# Altium project Analog_Digital_Testbed.PrjPcb
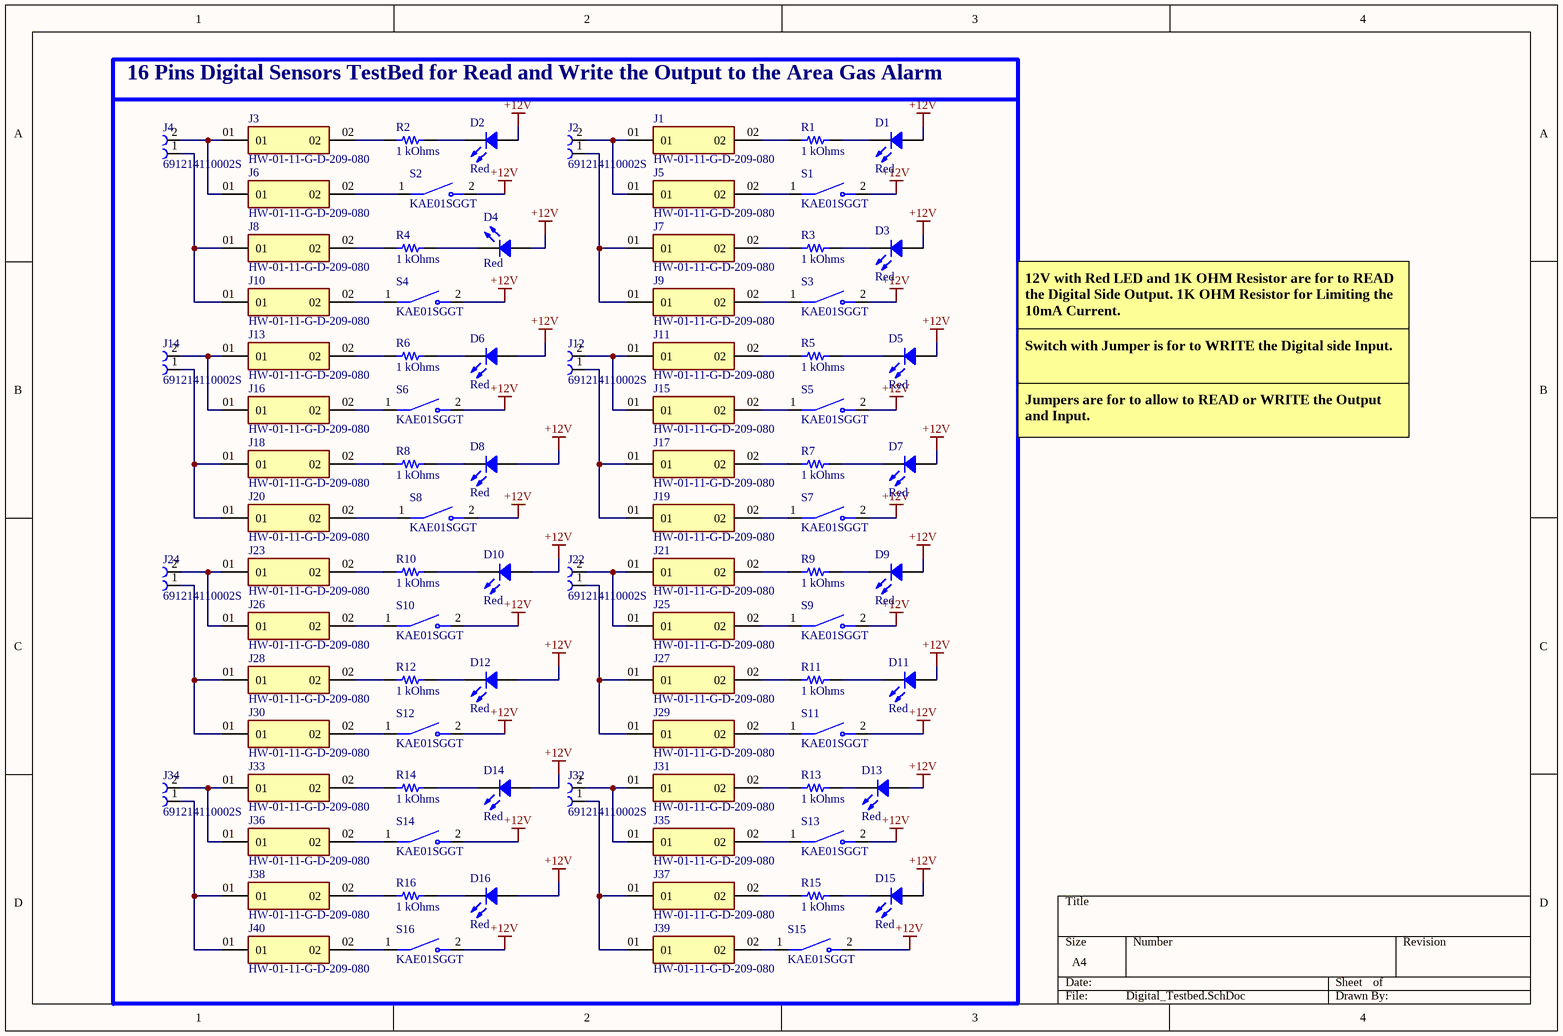
[diagram p0: Digital_Testbed.SchDoc]
4 sheets, 195 parts. Net scope: global (net labels, ports and power ports of the same name join across sheets).
Board file: PCB1.PcbDoc
Sheets:
  Digital_Testbed.SchDoc
  Analog_Testbed.SchDoc
  Voltage_Regulator.SchDoc
  rs485.SchDoc

## Sheet Digital_Testbed.SchDoc
size A4; SheetNumber: 1; SheetTotal: 4

### Parts
D1  Red  [LED 0603_1608 RED]
D2  Red  [LED 0603_1608 RED]
D3  Red  [LED 0603_1608 RED]
D4  Red  [LED 0603_1608 RED]
D5  Red  [LED 0603_1608 RED]
D6  Red  [LED 0603_1608 RED]
D7  Red  [LED 0603_1608 RED]
D8  Red  [LED 0603_1608 RED]
D9  Red  [LED 0603_1608 RED]
D10  Red  [LED 0603_1608 RED]
D11  Red  [LED 0603_1608 RED]
D12  Red  [LED 0603_1608 RED]
D13  Red  [LED 0603_1608 RED]
D14  Red  [LED 0603_1608 RED]
D15  Red  [LED 0603_1608 RED]
D16  Red  [LED 0603_1608 RED]
J1  HW-01-11-G-D-209-080  [SAMTEC_HW-01-11-G-D-209-080]
J2  691214110002S  [691214110002S]
J3  HW-01-11-G-D-209-080  [SAMTEC_HW-01-11-G-D-209-080]
J4  691214110002S  [691214110002S]
J5  HW-01-11-G-D-209-080  [SAMTEC_HW-01-11-G-D-209-080]
J6  HW-01-11-G-D-209-080  [SAMTEC_HW-01-11-G-D-209-080]
J7  HW-01-11-G-D-209-080  [SAMTEC_HW-01-11-G-D-209-080]
J8  HW-01-11-G-D-209-080  [SAMTEC_HW-01-11-G-D-209-080]
J9  HW-01-11-G-D-209-080  [SAMTEC_HW-01-11-G-D-209-080]
J10  HW-01-11-G-D-209-080  [SAMTEC_HW-01-11-G-D-209-080]
J11  HW-01-11-G-D-209-080  [SAMTEC_HW-01-11-G-D-209-080]
J12  691214110002S  [691214110002S]
J13  HW-01-11-G-D-209-080  [SAMTEC_HW-01-11-G-D-209-080]
J14  691214110002S  [691214110002S]
J15  HW-01-11-G-D-209-080  [SAMTEC_HW-01-11-G-D-209-080]
J16  HW-01-11-G-D-209-080  [SAMTEC_HW-01-11-G-D-209-080]
J17  HW-01-11-G-D-209-080  [SAMTEC_HW-01-11-G-D-209-080]
J18  HW-01-11-G-D-209-080  [SAMTEC_HW-01-11-G-D-209-080]
J19  HW-01-11-G-D-209-080  [SAMTEC_HW-01-11-G-D-209-080]
J20  HW-01-11-G-D-209-080  [SAMTEC_HW-01-11-G-D-209-080]
J21  HW-01-11-G-D-209-080  [SAMTEC_HW-01-11-G-D-209-080]
J22  691214110002S  [691214110002S]
J23  HW-01-11-G-D-209-080  [SAMTEC_HW-01-11-G-D-209-080]
J24  691214110002S  [691214110002S]
J25  HW-01-11-G-D-209-080  [SAMTEC_HW-01-11-G-D-209-080]
J26  HW-01-11-G-D-209-080  [SAMTEC_HW-01-11-G-D-209-080]
J27  HW-01-11-G-D-209-080  [SAMTEC_HW-01-11-G-D-209-080]
J28  HW-01-11-G-D-209-080  [SAMTEC_HW-01-11-G-D-209-080]
J29  HW-01-11-G-D-209-080  [SAMTEC_HW-01-11-G-D-209-080]
J30  HW-01-11-G-D-209-080  [SAMTEC_HW-01-11-G-D-209-080]
J31  HW-01-11-G-D-209-080  [SAMTEC_HW-01-11-G-D-209-080]
J32  691214110002S  [691214110002S]
J33  HW-01-11-G-D-209-080  [SAMTEC_HW-01-11-G-D-209-080]
J34  691214110002S  [691214110002S]
J35  HW-01-11-G-D-209-080  [SAMTEC_HW-01-11-G-D-209-080]
J36  HW-01-11-G-D-209-080  [SAMTEC_HW-01-11-G-D-209-080]
J37  HW-01-11-G-D-209-080  [SAMTEC_HW-01-11-G-D-209-080]
J38  HW-01-11-G-D-209-080  [SAMTEC_HW-01-11-G-D-209-080]
J39  HW-01-11-G-D-209-080  [SAMTEC_HW-01-11-G-D-209-080]
J40  HW-01-11-G-D-209-080  [SAMTEC_HW-01-11-G-D-209-080]
R1  1 kOhms  [RES 0603_1608]
R2  1 kOhms  [RES 0603_1608]
R3  1 kOhms  [RES 0603_1608]
R4  1 kOhms  [RES 0603_1608]
R5  1 kOhms  [RES 0603_1608]
R6  1 kOhms  [RES 0603_1608]
R7  1 kOhms  [RES 0603_1608]
R8  1 kOhms  [RES 0603_1608]
R9  1 kOhms  [RES 0603_1608]
R10  1 kOhms  [RES 0603_1608]
R11  1 kOhms  [RES 0603_1608]
R12  1 kOhms  [RES 0603_1608]
R13  1 kOhms  [RES 0603_1608]
R14  1 kOhms  [RES 0603_1608]
R15  1 kOhms  [RES 0603_1608]
R16  1 kOhms  [RES 0603_1608]
S1  KAE01SGGT  [SW_KAE01SGGT]
S2  KAE01SGGT  [SW_KAE01SGGT]
S3  KAE01SGGT  [SW_KAE01SGGT]
S4  KAE01SGGT  [SW_KAE01SGGT]
S5  KAE01SGGT  [SW_KAE01SGGT]
S6  KAE01SGGT  [SW_KAE01SGGT]
S7  KAE01SGGT  [SW_KAE01SGGT]
S8  KAE01SGGT  [SW_KAE01SGGT]
S9  KAE01SGGT  [SW_KAE01SGGT]
S10  KAE01SGGT  [SW_KAE01SGGT]
S11  KAE01SGGT  [SW_KAE01SGGT]
S12  KAE01SGGT  [SW_KAE01SGGT]
S13  KAE01SGGT  [SW_KAE01SGGT]
S14  KAE01SGGT  [SW_KAE01SGGT]
S15  KAE01SGGT  [SW_KAE01SGGT]
S16  KAE01SGGT  [SW_KAE01SGGT]

### Nets
+12V: D1.1 D2.1 D3.1 D4.1 D5.1 D6.1 D7.1 D8.1 D9.1 D10.1 D11.1 D12.1 D13.1 D14.1 D15.1 D16.1 S1.2 S2.2 S3.2 S4.2 S5.2 S6.2 S7.2 S8.2 S9.2 S10.2 S11.2 S12.2 S13.2 S14.2 S15.2 S16.2
NetD1_2: D1.2 R1.2
NetD2_2: D2.2 R2.2
NetD3_2: D3.2 R3.2
NetD4_2: D4.2 R4.2
NetD5_2: D5.2 R5.2
NetD6_2: D6.2 R6.2
NetD7_2: D7.2 R7.2
NetD8_2: D8.2 R8.2
NetD9_2: D9.2 R9.2
NetD10_2: D10.2 R10.2
NetD11_2: D11.2 R11.2
NetD12_2: D12.2 R12.2
NetD13_2: D13.2 R13.2
NetD14_2: D14.2 R14.2
NetD15_2: D15.2 R15.2
NetD16_2: D16.2 R16.2
NetJ1_01: J1.01 J2.2 J5.01
NetJ1_02: J1.02 R1.1
NetJ2_1: J2.1 J7.01 J9.01
NetJ3_01: J3.01 J4.2 J6.01
NetJ3_02: J3.02 R2.1
NetJ4_1: J4.1 J8.01 J10.01
NetJ5_02: J5.02 S1.1
NetJ6_02: J6.02 S2.1
NetJ7_02: J7.02 R3.1
NetJ8_02: J8.02 R4.1
NetJ9_02: J9.02 S3.1
NetJ10_02: J10.02 S4.1
NetJ11_01: J11.01 J12.2 J15.01
NetJ11_02: J11.02 R5.1
NetJ12_1: J12.1 J17.01 J19.01
NetJ13_01: J13.01 J14.2 J16.01
NetJ13_02: J13.02 R6.1
NetJ14_1: J14.1 J18.01 J20.01
NetJ15_02: J15.02 S5.1
NetJ16_02: J16.02 S6.1
NetJ17_02: J17.02 R7.1
NetJ18_02: J18.02 R8.1
NetJ19_02: J19.02 S7.1
NetJ20_02: J20.02 S8.1
NetJ21_01: J21.01 J22.2 J25.01
NetJ21_02: J21.02 R9.1
NetJ22_1: J22.1 J27.01 J29.01
NetJ23_01: J23.01 J24.2 J26.01
NetJ23_02: J23.02 R10.1
NetJ24_1: J24.1 J28.01 J30.01
NetJ25_02: J25.02 S9.1
NetJ26_02: J26.02 S10.1
NetJ27_02: J27.02 R11.1
NetJ28_02: J28.02 R12.1
NetJ29_02: J29.02 S11.1
NetJ30_02: J30.02 S12.1
NetJ31_01: J31.01 J32.2 J35.01
NetJ31_02: J31.02 R13.1
NetJ32_1: J32.1 J37.01 J39.01
NetJ33_01: J33.01 J34.2 J36.01
NetJ33_02: J33.02 R14.1
NetJ34_1: J34.1 J38.01 J40.01
NetJ35_02: J35.02 S13.1
NetJ36_02: J36.02 S14.1
NetJ37_02: J37.02 R15.1
NetJ38_02: J38.02 R16.1
NetJ39_02: J39.02 S15.1
NetJ40_02: J40.02 S16.1

### Notes on the sheet
- 16 Pins Digital Sensors TestBed for Read and Write the Output to the Area Gas Alarm
- 12V with Red LED and 1K OHM Resistor are for to READ the Digital Side Output. 1K OHM Resistor for Limiting the 10mA Current.
- Switch with Jumper is for to WRITE the Digital side Input.
- Jumpers are for to allow to READ or WRITE the Output and Input.

### Library data of the parts
D1-D16 = 19-213SDRC/S259/TR8: LED RED CLEAR 2SMD; Manufacturer: Everlight Electronics Co Ltd; Configuration: Standard; Current - Test: 10mA; Lens Color: Colorless; Lens Size: 1.20mm x 0.80mm; Lens Style: Rectangle with Flat Top; Viewing Angle: 120°; Voltage - Forward (Vf) (Typ): 2V; Wavelength - Peak: 650nm; Part Number: 19-213SDRC/S259/TR8; Color: Red; ComponentLink1Description: Datasheet; ComponentLink1URL: //media.digikey.com/pdf/Data%20Sheets/Everlight%20PDFs/19-213SDRC-S259-TR8.pdf; ComponentLink2Description: DigiKey Link; ComponentLink2URL: http://digikey.com/product-detail/en/everlight-electronics-co-ltd/19-213SDRC-S259-TR8/1080-1580-1-ND/8535303; Device Package: 0603 (1608 Metric); Height (Max): 0.70mm; LastUpdated: 08/03/2023 8:58:11 pm; Lens Transparency: Clear; Lifecycle Status: Active; Minimum Order: 1; Mounting Type: Surface Mount; Package / Case: 0603 (1608 Metric); Packaging: TapeAndReel; PartId: 372; Part Status: Active; Price: 0.06; Series: -; Size / Dimension: 1.60mm L x 0.80mm W; Supplier 1: DigiKey; Supplier Part Number 1: 1080-1580-1-ND; Supplier Device Package: 2-SMD; Value: Red
J1 J3 J5-J11 J13 J15-J21 J23 J25-J31 J33 J35-J40 = HW-01-11-G-D-209-080: CONN HDR 2POS STACK T/H; MF: Samtec; Purchase-URL: https://pricing.snapeda.com/search/part/HW-01-11-G-D-209-080/?ref=eda; Value: *; Package: None; Check_prices: https://www.snapeda.com/parts/HW-01-11-G-D-209-080/Samtec/view-part/?ref=eda; Price: None; MP: HW-01-11-G-D-209-080; Availability: In Stock; SnapEDA_Link: https://www.snapeda.com/parts/HW-01-11-G-D-209-080/Samtec/view-part/?ref=snap
J2 J4 J12 J14 J22 J24 J32 J34 = 691214110002S: 2 Position Wire to Board Terminal Block Horizontal with Board 0.138 (3.50mm) Through Hole; MF: WÃ¼rth Elektronik; Check_prices: https://www.snapeda.com/parts/691214110002S/Wurth+Elektronik/view-part/?ref=eda; Availability: In Stock; Price: None; Package: None; Value: *; SnapEDA_Link: https://www.snapeda.com/parts/691214110002S/Wurth+Elektronik/view-part/?ref=snap; MP: 691214110002S; Purchase-URL: https://pricing.snapeda.com/search/part/691214110002S/?ref=eda
R1-R16 = CPF0603B1K0E: RES SMD 1K OHM 0.1% 1/16W 0603; Manufacturer: TE Connectivity Passive Product; Power (Watts): 0.063W, 1/16W; Temperature Coefficient: ±25ppm/°C; Part Number: CPF0603B1K0E; Value: 1 kOhms; ComponentLink1Description: Datasheet; ComponentLink1URL: https://www.te.com/commerce/DocumentDelivery/DDEController?Action=srchrtrv&DocNm=1773200&DocType=DS&DocLang=English; ComponentLink2Description: DigiKey Link; ComponentLink2URL: https://www.digikey.com/en/products/detail/te-connectivity-passive-product/CPF0603B1K0E/2390473; Composition: Thin Film; Device Package: 0603 (1608 Metric); Height - Seated (Max): 0.022" (0.55mm); LastUpdated: 08/03/2023 8:30:18 pm; Lifecycle Status: Active; Minimum Order: 1; Number of Terminations: 2; Operating Temperature: -55°C ~ 155°C; Package / Case: 0603 (1608 Metric); Packaging: TapeAndReel; PartId: 4877; Part Status: Active; Price: 0.09; Resistance: 1 kOhms; Series: CPF, Neohm; Size / Dimension: 0.061" L x 0.031" W (1.55mm x 0.80mm); Supplier 1: DigiKey; Supplier Part Number 1: A119887CT-ND; Supplier Device Package: 0603; Tolerance: ±0.1%
S1-S16 = KAE01SGGT: Dip Switch SPST 1 Position Surface Mount Slide (Standard) Actuator 25mA 24VDC; MF: E-Switch; Check_prices: https://www.snapeda.com/parts/KAE01SGGT/E-Switch/view-part/?ref=eda; Value: *; Availability: In Stock; MP: KAE01SGGT; Price: None; Package: None; SnapEDA_Link: https://www.snapeda.com/parts/KAE01SGGT/E-Switch/view-part/?ref=snap; Purchase-URL: https://pricing.snapeda.com/search/part/KAE01SGGT/?ref=eda

## Sheet Analog_Testbed.SchDoc
size A4; SheetNumber: 2; SheetTotal: 4
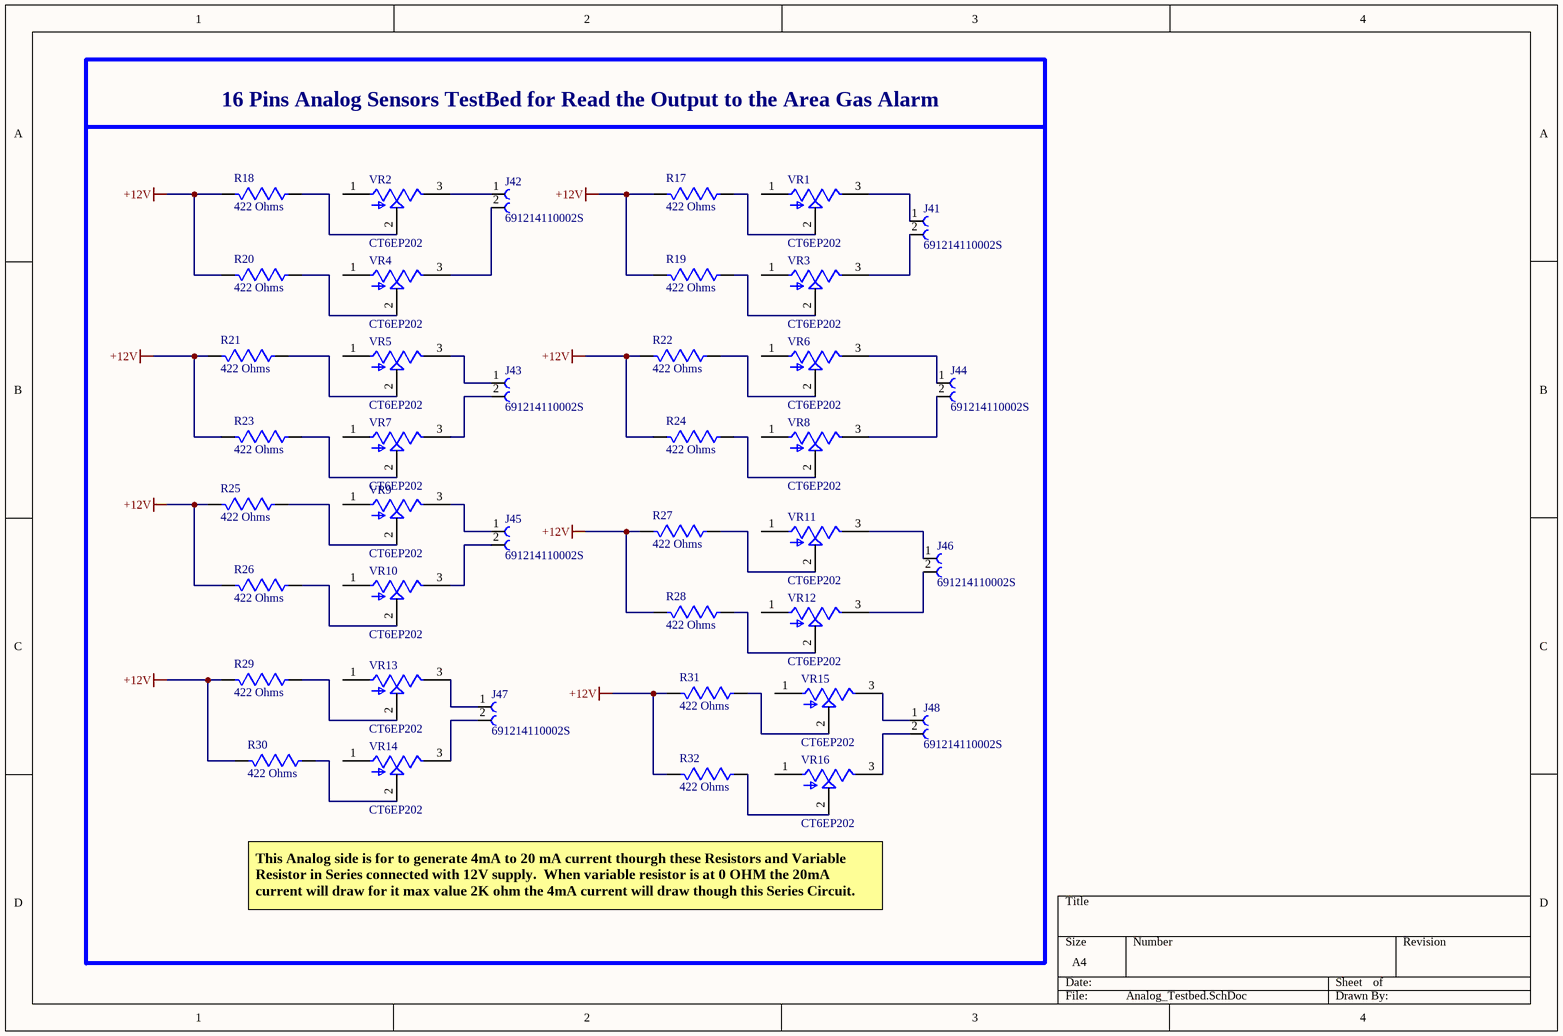
[diagram p1: Analog_Testbed.SchDoc]

### Parts
J41  691214110002S  [691214110002S]
J42  691214110002S  [691214110002S]
J43  691214110002S  [691214110002S]
J44  691214110002S  [691214110002S]
J45  691214110002S  [691214110002S]
J46  691214110002S  [691214110002S]
J47  691214110002S  [691214110002S]
J48  691214110002S  [691214110002S]
R17  422 Ohms  [RES_422]
R18  422 Ohms  [RES_422]
R19  422 Ohms  [RES_422]
R20  422 Ohms  [RES_422]
R21  422 Ohms  [RES_422]
R22  422 Ohms  [RES_422]
R23  422 Ohms  [RES_422]
R24  422 Ohms  [RES_422]
R25  422 Ohms  [RES_422]
R26  422 Ohms  [RES_422]
R27  422 Ohms  [RES_422]
R28  422 Ohms  [RES_422]
R29  422 Ohms  [RES_422]
R30  422 Ohms  [RES_422]
R31  422 Ohms  [RES_422]
R32  422 Ohms  [RES_422]
VR1  CT6EP202  [CT6EP202]
VR2  CT6EP202  [CT6EP202]
VR3  CT6EP202  [CT6EP202]
VR4  CT6EP202  [CT6EP202]
VR5  CT6EP202  [CT6EP202]
VR6  CT6EP202  [CT6EP202]
VR7  CT6EP202  [CT6EP202]
VR8  CT6EP202  [CT6EP202]
VR9  CT6EP202  [CT6EP202]
VR10  CT6EP202  [CT6EP202]
VR11  CT6EP202  [CT6EP202]
VR12  CT6EP202  [CT6EP202]
VR13  CT6EP202  [CT6EP202]
VR14  CT6EP202  [CT6EP202]
VR15  CT6EP202  [CT6EP202]
VR16  CT6EP202  [CT6EP202]

### Nets
+12V: R17.1(CCW) R18.1(CCW) R19.1(CCW) R20.1(CCW) R21.1(CCW) R22.1(CCW) R23.1(CCW) R24.1(CCW) R25.1(CCW) R26.1(CCW) R27.1(CCW) R28.1(CCW) R29.1(CCW) R30.1(CCW) R31.1(CCW) R32.1(CCW)
NetJ41_1: J41.1 VR1.3(CW)
NetJ41_2: J41.2 VR3.3(CW)
NetJ42_1: J42.1 VR2.3(CW)
NetJ42_2: J42.2 VR4.3(CW)
NetJ43_1: J43.1 VR5.3(CW)
NetJ43_2: J43.2 VR7.3(CW)
NetJ44_1: J44.1 VR6.3(CW)
NetJ44_2: J44.2 VR8.3(CW)
NetJ45_1: J45.1 VR9.3(CW)
NetJ45_2: J45.2 VR10.3(CW)
NetJ46_1: J46.1 VR11.3(CW)
NetJ46_2: J46.2 VR12.3(CW)
NetJ47_1: J47.1 VR13.3(CW)
NetJ47_2: J47.2 VR14.3(CW)
NetJ48_1: J48.1 VR15.3(CW)
NetJ48_2: J48.2 VR16.3(CW)
NetR17_2: R17.2(CW) VR1.2(WIPER)
NetR18_2: R18.2(CW) VR2.2(WIPER)
NetR19_2: R19.2(CW) VR3.2(WIPER)
NetR20_2: R20.2(CW) VR4.2(WIPER)
NetR21_2: R21.2(CW) VR5.2(WIPER)
NetR22_2: R22.2(CW) VR6.2(WIPER)
NetR23_2: R23.2(CW) VR7.2(WIPER)
NetR24_2: R24.2(CW) VR8.2(WIPER)
NetR25_2: R25.2(CW) VR9.2(WIPER)
NetR26_2: R26.2(CW) VR10.2(WIPER)
NetR27_2: R27.2(CW) VR11.2(WIPER)
NetR28_2: R28.2(CW) VR12.2(WIPER)
NetR29_2: R29.2(CW) VR13.2(WIPER)
NetR30_2: R30.2(CW) VR14.2(WIPER)
NetR31_2: R31.2(CW) VR15.2(WIPER)
NetR32_2: R32.2(CW) VR16.2(WIPER)

Not connected (* = marked no-connect by the designer): VR1 1(CCW); VR2 1(CCW); VR3 1(CCW); VR4 1(CCW); VR5 1(CCW); VR6 1(CCW); VR7 1(CCW); VR8 1(CCW); VR9 1(CCW); VR10 1(CCW); VR11 1(CCW); VR12 1(CCW); VR13 1(CCW); VR14 1(CCW); VR15 1(CCW); VR16 1(CCW)

### Notes on the sheet
- 16 Pins Analog Sensors TestBed for Read the Output to the Area Gas Alarm
- This Analog side is for to generate 4mA to 20 mA current thourgh these Resistors and Variable Resistor in Series connected with 12V supply.  When variable resistor is at 0 OHM the 20mA current will draw for it max value 2K ohm the 4mA current will draw though this Series Circuit.

### Library data of the parts
J41-J48 = 691214110002S: as J2 on sheet Digital_Testbed; Check_prices: https://www.snapeda.com/parts/691214110002S/Wurth+Elektronik/view-part/?ref=eda; Availability: In Stock; Price: None; Package: None; Value: *; SnapEDA_Link: https://www.snapeda.com/parts/691214110002S/Wurth+Elektronik/view-part/?ref=snap; MP: 691214110002S; Purchase-URL: https://pricing.snapeda.com/search/part/691214110002S/?ref=eda
R17-R32 = RES_422: 1W Thick Film Resistors 200V ±100ppm/℃ ±1% -55℃~+155℃ 422Ω 2512 Chip Resistor - Surface Mount ROHS

## Sheet Voltage_Regulator.SchDoc
size A3; SheetNumber: 3; SheetTotal: 4
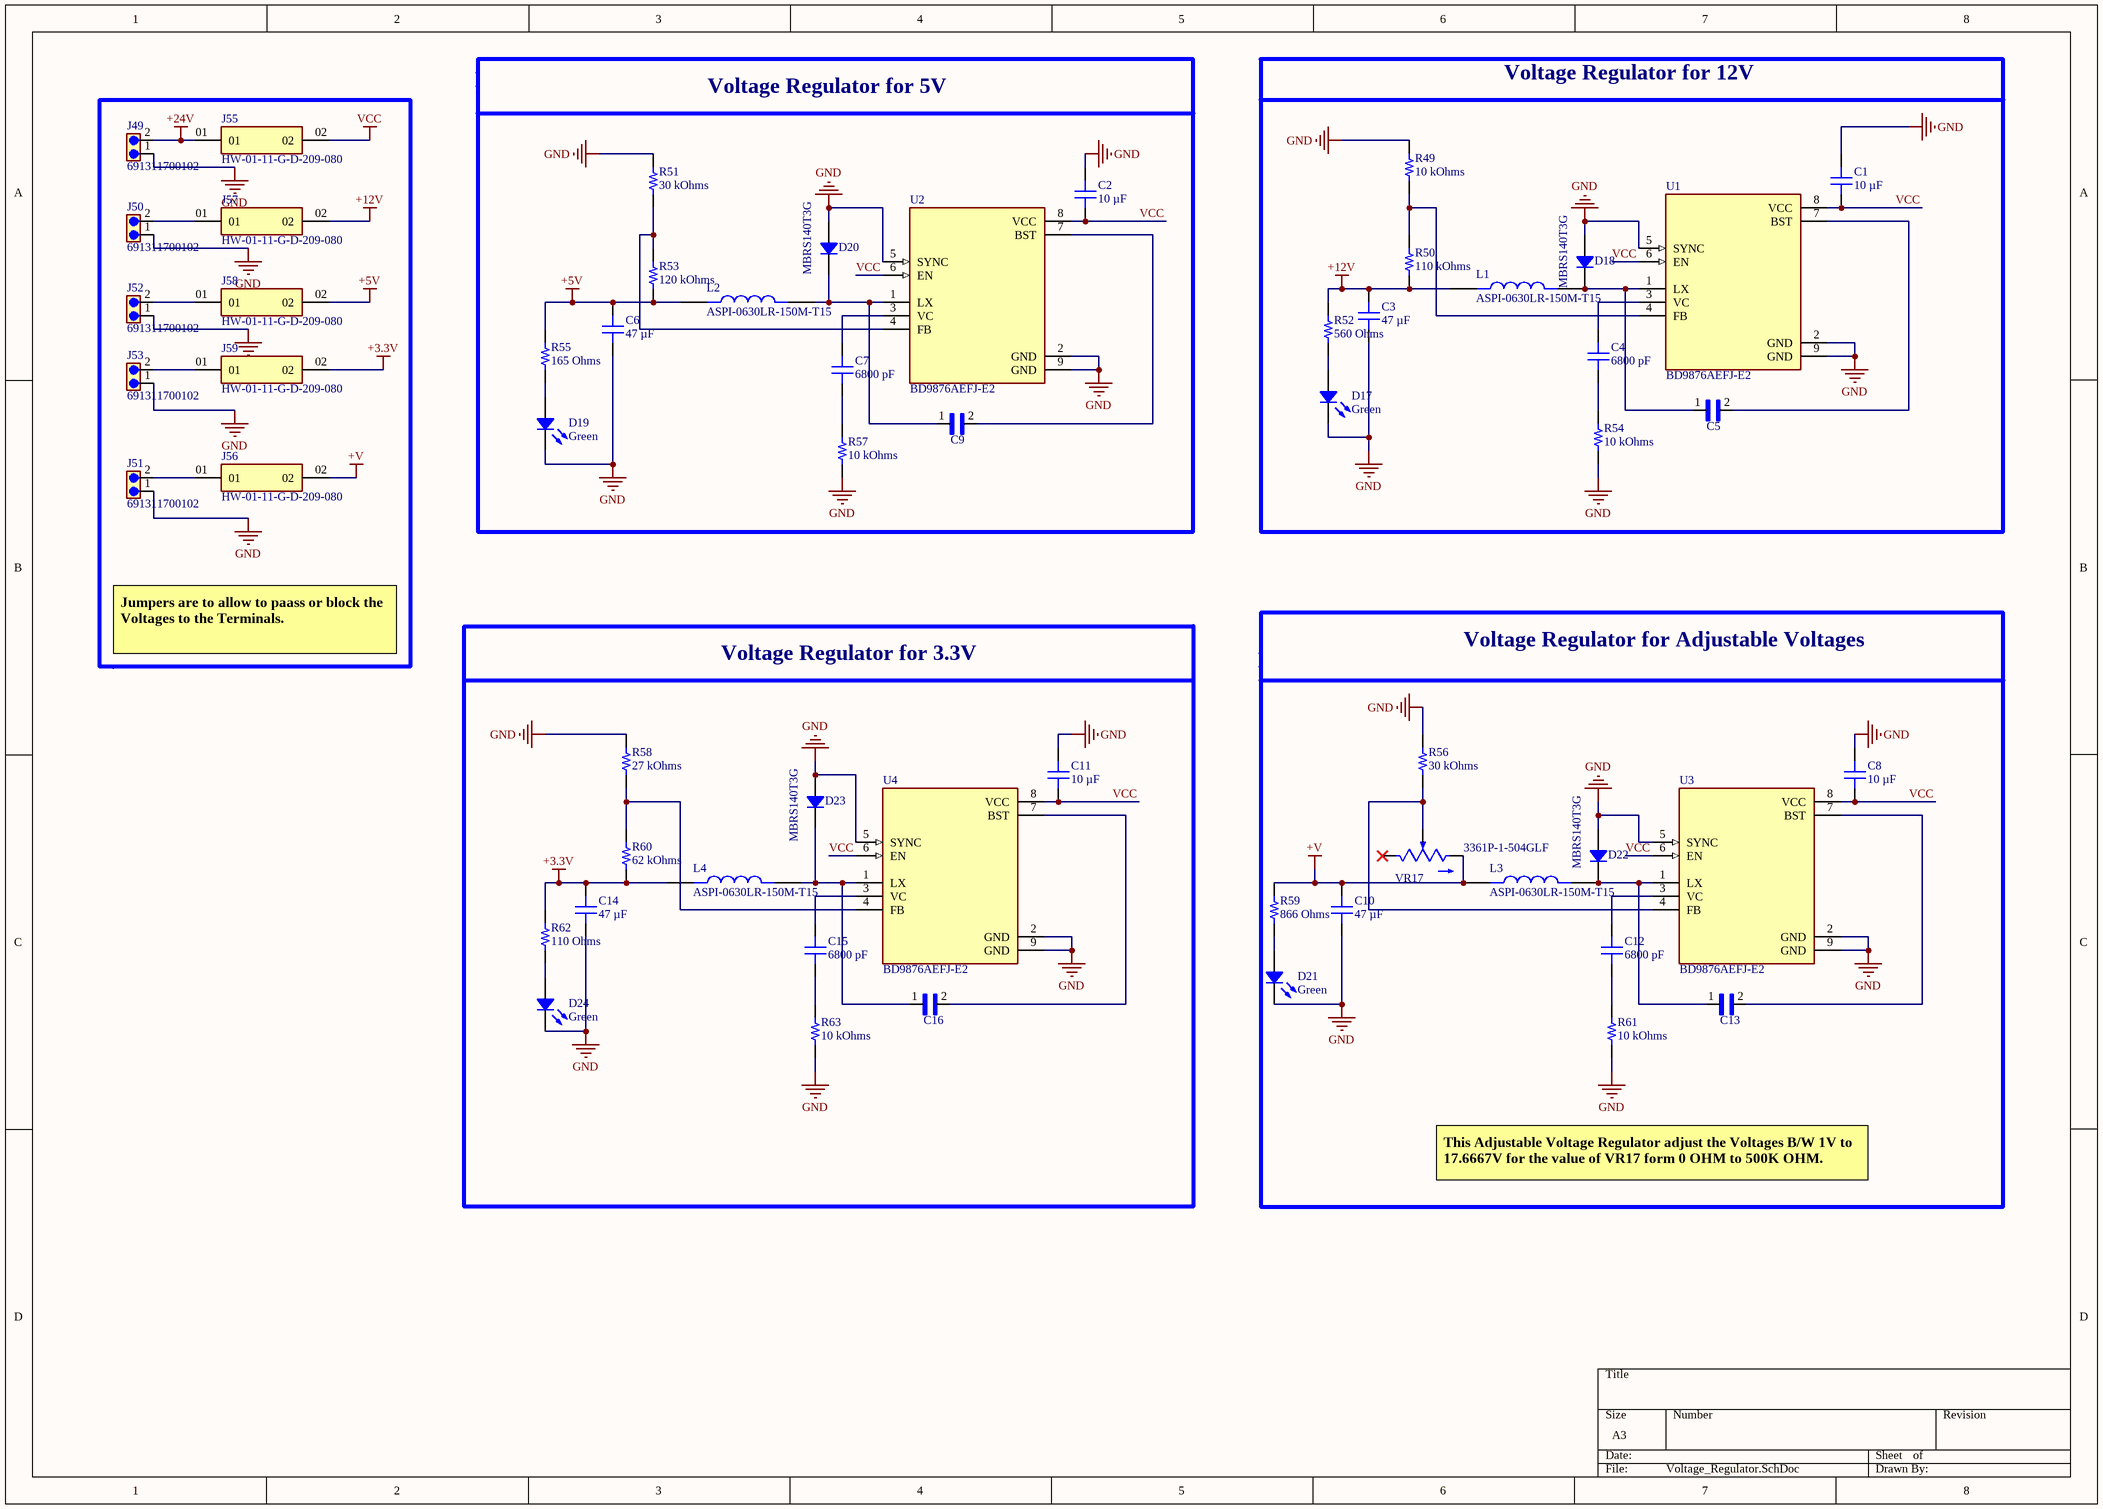
[diagram p2: Voltage_Regulator.SchDoc]

### Parts
C1  10 µF  [CAP 0603_1608]
C2  10 µF  [CAP 0603_1608]
C3  47 µF  [CAP 0603_1608]
C4  6800 pF  [CAP 0603_1608]
C5  C0603C103J5REC7411  [CAPC1608X87N]  (value not drawn)
C6  47 µF  [CAP 0603_1608]
C7  6800 pF  [CAP 0603_1608]
C8  10 µF  [CAP 0603_1608]
C9  C0603C103J5REC7411  [CAPC1608X87N]  (value not drawn)
C10  47 µF  [CAP 0603_1608]
C11  10 µF  [CAP 0603_1608]
C12  6800 pF  [CAP 0603_1608]
C13  C0603C103J5REC7411  [CAPC1608X87N]  (value not drawn)
C14  47 µF  [CAP 0603_1608]
C15  6800 pF  [CAP 0603_1608]
C16  C0603C103J5REC7411  [CAPC1608X87N]  (value not drawn)
D17  Green  [LED 0805_2012 GREEN]
D18  MBRS140T3G  [DO214AA SMB]
D19  Green  [LED 0805_2012 GREEN]
D20  MBRS140T3G  [DO214AA SMB]
D21  Green  [LED 0805_2012 GREEN]
D22  MBRS140T3G  [DO214AA SMB]
D23  MBRS140T3G  [DO214AA SMB]
D24  Green  [LED 0805_2012 GREEN]
J49  691311700102  [691311700102]
J50  691311700102  [691311700102]
J51  691311700102  [691311700102]
J52  691311700102  [691311700102]
J53  691311700102  [691311700102]
J55  HW-01-11-G-D-209-080  [SAMTEC_HW-01-11-G-D-209-080]
J56  HW-01-11-G-D-209-080  [SAMTEC_HW-01-11-G-D-209-080]
J57  HW-01-11-G-D-209-080  [SAMTEC_HW-01-11-G-D-209-080]
J58  HW-01-11-G-D-209-080  [SAMTEC_HW-01-11-G-D-209-080]
J59  HW-01-11-G-D-209-080  [SAMTEC_HW-01-11-G-D-209-080]
L1  ASPI-0630LR-150M-T15  [IND_ASPI-0630LR-150M-T15]
L2  ASPI-0630LR-150M-T15  [IND_ASPI-0630LR-150M-T15]
L3  ASPI-0630LR-150M-T15  [IND_ASPI-0630LR-150M-T15]
L4  ASPI-0630LR-150M-T15  [IND_ASPI-0630LR-150M-T15]
R49  10 kOhms  [RES 0603_1608]
R50  110 kOhms  [RES 0603_1608]
R51  30 kOhms  [RES 0603_1608]
R52  560 Ohms  [RES 0603_1608]
R53  120 kOhms  [RES 0603_1608]
R54  10 kOhms  [RES 0603_1608]
R55  165 Ohms  [RES 0603_1608]
R56  30 kOhms  [RES 0603_1608]
R57  10 kOhms  [RES 0603_1608]
R58  27 kOhms  [RES 0603_1608]
R59  866 Ohms  [RES 0603_1608]
R60  62 kOhms  [RES 0603_1608]
R61  10 kOhms  [RES 0603_1608]
R62  110 Ohms  [RES 0603_1608]
R63  10 kOhms  [RES 0603_1608]
U1  BD9876AEFJ-E2  [SOIC127P600X100-9N]
U2  BD9876AEFJ-E2  [SOIC127P600X100-9N]
U3  BD9876AEFJ-E2  [SOIC127P600X100-9N]
U4  BD9876AEFJ-E2  [SOIC127P600X100-9N]
VR17  3361P-1-504GLF  [TRIM_3361P-1-504GLF]

### Blocks framed on the sheet
Voltage Regulator for 12V: C1 C3-C5 D17 D18 L1 R49 R50 R52 R54 U1
Voltage Regulator for 3.3V: C11 C14-C16 D23 D24 L4 R58 R60 R62 R63 U4

### Nets
+3.3V: C14.2 J59.02 L4.1 R60.2 R62.2
+5V: C6.2 J58.02 L2.1 R53.1 R55.2
+12V: C3.2 J57.02 L1.1 R50.1 R52.2
+24V: J49.2 J55.01
+V: C10.2 J56.02 L3.1 R59.2 VR17.3(CW)
GND: C1.2 C2.2 C3.1 C6.1 C8.2 C10.1 C11.2 C14.1 D17.2 D18.1 D19.2 D20.1 D21.2 D22.1 D23.1 D24.2 J49.1 J50.1 J51.1 J52.1 J53.1 R49.2 R51.2 R54.1 R56.2 R57.1 R58.2 R61.1 R63.1 U1.2(GND) U1.5(SYNC) U1.9(GND) U2.2(GND) U2.5(SYNC) U2.9(GND) U3.2(GND) U3.5(SYNC) U3.9(GND) U4.2(GND) U4.5(SYNC) U4.9(GND)
VCC: C1.1 C2.1 C8.1 C11.1 J55.02 U1.6(EN) U1.8(VCC) U2.6(EN) U2.8(VCC) U3.6(EN) U3.8(VCC) U4.6(EN) U4.8(VCC)
NetC4_1: C4.1 R54.2
NetC4_2: C4.2 U1.3(VC)
NetC5_1: C5.1 D18.2 L1.2 U1.1(LX)
NetC5_2: C5.2 U1.7(BST)
NetC7_1: C7.1 R57.2
NetC7_2: C7.2 U2.3(VC)
NetC9_1: C9.1 D20.2 L2.2 U2.1(LX)
NetC9_2: C9.2 U2.7(BST)
NetC12_1: C12.1 R61.2
NetC12_2: C12.2 U3.3(VC)
NetC13_1: C13.1 D22.2 L3.2 U3.1(LX)
NetC13_2: C13.2 U3.7(BST)
NetC15_1: C15.1 R63.2
NetC15_2: C15.2 U4.3(VC)
NetC16_1: C16.1 D23.2 L4.2 U4.1(LX)
NetC16_2: C16.2 U4.7(BST)
NetD17_1: D17.1 R52.1
NetD19_1: D19.1 R55.1
NetD21_1: D21.1 R59.1
NetD24_1: D24.1 R62.1
NetJ50_2: J50.2 J57.01
NetJ51_2: J51.2 J56.01
NetJ52_2: J52.2 J58.01
NetJ53_2: J53.2 J59.01
NetR49_1: R49.1 R50.2 U1.4(FB)
NetR51_1: R51.1 R53.2 U2.4(FB)
NetR56_1: R56.1 U3.4(FB) VR17.2(WIPER)
NetR58_1: R58.1 R60.1 U4.4(FB)

Not connected (* = marked no-connect by the designer): VR17 1(CCW)*

### Notes on the sheet
- Voltage Regulator for 5V
- Jumpers are to allow to paass or block the Voltages to the Terminals.
- Voltage Regulator for Adjustable Voltages
- This Adjustable Voltage Regulator adjust the Voltages B/W 1V to 17.6667V for the value of VR17 form 0 OHM to 500K OHM.

### Library data of the parts
C1 C2 C8 C11 = 0603DD106MAT2A: CAP CER 10UF 35V X5R 0603; manufacturer: KYOCERA AVX; Tolerance: ±20%; Part Number: 0603DD106MAT2A; Value: 10 µF; Applications: General Purpose; Capacitance: 10 µF; componentlink2description: DigiKey Link; componentlink2url: https://www.digikey.com/en/products/detail/kyocera-avx/0603DD106MAT2A/16602926; Device Package: 0603 (1608 Metric); lastupdated: 08/03/2023 8:07:23 pm; Lifecycle Status: Active; Minimum Order: 1; Mounting Type: Surface Mount, MLCC; Operating Temperature: -55°C ~ 85°C; Package / Case: 0603 (1608 Metric); packaging: TapeAndReel; partid: 46895; Part Status: Active; price: 0.05; series: -; Size / Dimension: 0.063" L x 0.031" W (1.60mm x 0.80mm); Supplier 1: DigiKey; Supplier Part Number 1: 478-0603DD106MAT2ACT-ND; Temperature Coefficient: X5R; Voltage - Rated: 35V
C3 C6 C10 C14 = GRM188R60J476ME15D: CAP CER 47UF 6.3V X5R 0603; manufacturer: Murata Electronics; Tolerance: ±20%; Part Number: GRM188R60J476ME15D; Value: 47 µF; Applications: General Purpose; Capacitance: 47 µF; componentlink1description: Datasheet; componentlink1url: https://www.murata.com/~/media/webrenewal/support/library/catalog/products/capacitor/mlcc/c02e.ashx?la=en-us; componentlink2description: DigiKey Link; componentlink2url: https://www.digikey.com/en/products/detail/murata-electronics/GRM188R60J476ME15D/5877410; Device Package: 0603 (1608 Metric); lastupdated: 08/03/2023 8:08:50 pm; Lifecycle Status: Active; Minimum Order: 1; Mounting Type: Surface Mount, MLCC; Operating Temperature: -55°C ~ 85°C; Package / Case: 0603 (1608 Metric); packaging: TapeAndReel; partid: 5468; Part Status: Active; price: 0.10; series: GRM; Size / Dimension: 0.063" L x 0.031" W (1.60mm x 0.80mm); Supplier 1: DigiKey; Supplier Part Number 1: 490-13247-1-ND; Temperature Coefficient: X5R; Thickness (Max): 0.039" (1.00mm); Voltage - Rated: 6.3V
C4 C7 C12 C15 = EMK107SD682JA-T: CAP CER 6800PF 16V 0603; manufacturer: Taiyo Yuden; Tolerance: ±5%; Part Number: EMK107SD682JA-T; Value: 6800 pF; Applications: General Purpose; Capacitance: 6800 pF; componentlink1description: Datasheet; componentlink1url: http://www.yuden.co.jp/productdata/catalog/mlcc07_e.pdf; componentlink2description: DigiKey Link; componentlink2url: https://www.digikey.com/en/products/detail/taiyo-yuden/EMK107SD682JA-T/930441; Device Package: 0603 (1608 Metric); Features: Low Distortion; lastupdated: 08/03/2023 8:08:44 pm; Lifecycle Status: Active; Minimum Order: 1; Mounting Type: Surface Mount, MLCC; Operating Temperature: -55°C ~ 125°C; Package / Case: 0603 (1608 Metric); packaging: TapeAndReel; partid: 7463; Part Status: Active; price: 0.07; series: CFCAP™; Size / Dimension: 0.063" L x 0.031" W (1.60mm x 0.80mm); Supplier 1: DigiKey; Supplier Part Number 1: 587-1089-1-ND; Thickness (Max): 0.035" (0.90mm); Voltage - Rated: 16V
C5 C9 C13 C16 = C0603C103J5REC7411: 10000pF Â±5% 50V Ceramic Capacitor X7R 0603 (1608 Metric); MF: KEMET; DigiKey-Purchase-URL: https://snapeda.com/shop?store=DigiKey&id=2066766; MP: C0603C103J5REC7411; Availability: Unavailable; Package: 1608 KEMET; Value: *; Price: None; SnapEDA_Link: https://www.snapeda.com/parts/C0603C103J5REC7411/KEMET/view-part/2066766/?ref=snap
D17 D19 D21 D24 = QTLP630C4TR: LED GREEN CLEAR 0805 SMD; Manufacturer: Everlight Electronics Co Ltd; Configuration: Standard; Current - Test: 20mA; Lens Color: Colorless; Lens Size: 1.40mm x 1.25mm; Lens Style: Rectangle with Flat Top; Millicandela Rating: 10mcd; Viewing Angle: 140°; Voltage - Forward (Vf) (Typ): 2.1V; Wavelength - Dominant: 570nm; Wavelength - Peak: 565nm; Part Number: QTLP630C4TR; Color: Green; ComponentLink1Description: Datasheet; ComponentLink1URL: //media.digikey.com/PDF/Data%20Sheets/Everlight%20PDFs/QTLP630-2.pdf; ComponentLink2Description: DigiKey Link; ComponentLink2URL: https://www.digikey.com/en/products/detail/everlight-electronics-co-ltd/QTLP630C4TR/2675902; Device Package: 0805 (2012 Metric); Height (Max): 1.20mm; LastUpdated: 08/03/2023 8:58:32 pm; Lens Transparency: Clear; Lifecycle Status: Active; Minimum Order: 1; Mounting Type: Surface Mount; Package / Case: 0805 (2012 Metric); Packaging: TapeAndReel; PartId: 240; Part Status: Active; Price: 0.04; Series: -; Size / Dimension: 2.00mm L x 1.25mm W; Supplier 1: DigiKey; Supplier Part Number 1: 1080-1411-1-ND; Supplier Device Package: 0805; Value: Green
D18 D20 D22 D23 = MBRS140T3G: DIODE SCHOTTKY 40V 1A SMB; Manufacturer: ON Semiconductor; Current - Reverse Leakage @ Vr: 1mA @ 40V; Speed: Fast Recovery =< 500ns, > 200mA (Io); Voltage - Forward (Vf) (Max) @ If: 600mV @ 1A; Part Number: MBRS140T3G; ComponentLink1Description: Datasheet; ComponentLink1URL: https://www.onsemi.com/pub/Collateral/MBRS140T3-D.PDF; ComponentLink2Description: DigiKey Link; ComponentLink2URL: http://digikey.com/product-detail/en/on-semiconductor/MBRS140T3G/MBRS140T3GOSCT-ND/918002; Current - Average Rectified (Io): 1A; Diode Type: Schottky; LastUpdated: 08/03/2023 8:53:35 pm; Lifecycle Status: Active; Minimum Order: 1; Mounting Type: Surface Mount; Operating Temperature - Junction: -65°C ~ 125°C; Package / Case: DO-214AA, SMB; Packaging: TapeAndReel; PartId: 1387; Part Status: Active; Price: 0.08; Series: -; Supplier 1: DigiKey; Supplier Part Number 1: MBRS140T3GOSCT-ND; Supplier Device Package: SMB; Voltage - DC Reverse (Vr) (Max): 40V
J49-J53 = 691311700102: 2 Position Terminal Block Header, Male Pins, Shrouded (4 Side) 0.197 (5.00mm) Vertical - Through Hole; MF: WÃ¼rth Elektronik; Value: *; Check_prices: https://www.snapeda.com/parts/691311700102/Wurth+Elektronik/view-part/?ref=eda; Availability: In Stock; Package: None; SnapEDA_Link: https://www.snapeda.com/parts/691311700102/Wurth+Elektronik/view-part/?ref=snap; Purchase-URL: https://pricing.snapeda.com/search/part/691311700102/?ref=eda; Price: None; MP: 691311700102
J55-J59 = HW-01-11-G-D-209-080: CONN HDR 2POS STACK T/H; MF: Samtec; Purchase-URL: https://pricing.snapeda.com/search/part/HW-01-11-G-D-209-080/?ref=eda; Value: *; Package: None; Check_prices: https://www.snapeda.com/parts/HW-01-11-G-D-209-080/Samtec/view-part/?ref=eda; Price: None; MP: HW-01-11-G-D-209-080; Availability: In Stock; SnapEDA_Link: https://www.snapeda.com/parts/HW-01-11-G-D-209-080/Samtec/view-part/?ref=snap
L1-L4 = ASPI-0630LR-150M-T15: 15 ÂµH Shielded Molded Inductor 3 A 120mOhm Max Nonstandard; MF: Abracon LLC; Check_prices: https://www.snapeda.com/parts/ASPI-0630LR-150M-T15/Abracon+LLC/view-part/?ref=eda; Digi-Key_Part_Number: ASPI-0630LR-150M-T15TR-ND; Value: *; SnapEDA_Link: https://www.snapeda.com/parts/ASPI-0630LR-150M-T15/Abracon+LLC/view-part/?ref=snap; Package: Nonstandard Abracon LLC; MP: ASPI-0630LR-150M-T15; Purchase-URL: https://pricing.snapeda.com/search/part/ASPI-0630LR-150M-T15/?ref=eda
R49 = RT0603FRE0710KL: RES SMD 10K OHM 1% 1/10W 0603; Manufacturer: Yageo; Power (Watts): 0.1W, 1/10W; Temperature Coefficient: ±50ppm/°C; Part Number: RT0603FRE0710KL; Value: 10 kOhms; ComponentLink1Description: Datasheet; ComponentLink1URL: https://www.yageo.com/upload/media/product/productsearch/datasheet/rchip/PYu-RT_1-to-0.01_RoHS_L_11.pdf; ComponentLink2Description: DigiKey Link; ComponentLink2URL: https://www.digikey.com/en/products/detail/yageo/RT0603FRE0710KL/1075040; Composition: Thin Film; Device Package: 0603 (1608 Metric); Height - Seated (Max): 0.022" (0.55mm); LastUpdated: 08/03/2023 8:30:15 pm; Lifecycle Status: Active; Minimum Order: 1; Number of Terminations: 2; Operating Temperature: -55°C ~ 155°C; Package / Case: 0603 (1608 Metric); Packaging: TapeAndReel; PartId: 5671; Part Status: Active; Price: 0.01; Resistance: 10 kOhms; Series: RT; Size / Dimension: 0.063" L x 0.031" W (1.60mm x 0.80mm); Supplier 1: DigiKey; Supplier Part Number 1: YAG2321CT-ND; Supplier Device Package: 0603; Tolerance: ±1%
R50 = CRCW0603110KFKEA: RES SMD 110K OHM 1% 1/10W 0603; Manufacturer: Vishay Dale; Power (Watts): 0.1W, 1/10W; Temperature Coefficient: ±100ppm/°C; Part Number: CRCW0603110KFKEA; Value: 110 kOhms; ComponentLink1Description: Datasheet; ComponentLink1URL: http://www.vishay.com/docs/20035/dcrcwe3.pdf; ComponentLink2Description: DigiKey Link; ComponentLink2URL: http://digikey.com/product-detail/en/vishay-dale/CRCW0603110KFKEA/541-110KHCT-ND/1180042; Composition: Thick Film; Device Package: 0603 (1608 Metric); Features: Automotive AEC-Q200; Height - Seated (Max): 0.020" (0.50mm); LastUpdated: 08/03/2023 8:30:07 pm; Lifecycle Status: Active; Minimum Order: 1; Number of Terminations: 2; Operating Temperature: -55°C ~ 155°C; Package / Case: 0603 (1608 Metric); Packaging: CutTape; PartId: 7799; Part Status: Active; Price: 0.10; Ratings: AEC-Q200; Resistance: 110 kOhms; Series: CRCW; Size / Dimension: 0.061" L x 0.033" W (1.55mm x 0.85mm); Supplier 1: DigiKey; Supplier Part Number 1: 541-110KHCT-ND; Supplier Device Package: 0603; Tolerance: ±1%
R51 R56 = RMCF0603FT30K0: RES 30K OHM 1% 1/10W 0603; Manufacturer: Stackpole Electronics Inc; Power (Watts): 0.1W, 1/10W; Temperature Coefficient: ±100ppm/°C; Part Number: RMCF0603FT30K0; Value: 30 kOhms; ComponentLink1Description: Datasheet; ComponentLink1URL: https://www.seielect.com/catalog/sei-rmcf_rmcp.pdf; ComponentLink2Description: DigiKey Link; ComponentLink2URL: https://www.digikey.com/en/products/detail/stackpole-electronics-inc/RMCF0603FT30K0/1760793; Composition: Thick Film; Device Package: 0603 (1608 Metric); Features: Automotive AEC-Q200; Height - Seated (Max): 0.022" (0.55mm); LastUpdated: 08/03/2023 8:29:57 pm; Lifecycle Status: Active; Minimum Order: 1; Number of Terminations: 2; Operating Temperature: -55°C ~ 155°C; Package / Case: 0603 (1608 Metric); Packaging: CutTape; PartId: 10655; Part Status: Active; Price: 0.01; Ratings: AEC-Q200; Resistance: 30 kOhms; Series: RMCF; Size / Dimension: 0.061" L x 0.031" W (1.55mm x 0.80mm); Supplier 1: DigiKey; Supplier Part Number 1: RMCF0603FT30K0CT-ND; Supplier Device Package: 0603; Tolerance: ±1%
R52 = MCT06030C5600FP500: RES SMD 560 OHM 1% 1/8W 0603; Manufacturer: Vishay Beyschlag; Power (Watts): 0.125W, 1/8W; Temperature Coefficient: ±50ppm/°C; Part Number: MCT06030C5600FP500; Value: 560 Ohms; ComponentLink1Description: Datasheet; ComponentLink1URL: http://www.vishay.com/docs/28705/mcx0x0xpro.pdf; ComponentLink2Description: DigiKey Link; ComponentLink2URL: http://digikey.com/product-detail/en/vishay-beyschlag/MCT06030C5600FP500/MCT0603-560-CFCT-ND/2607914; Composition: Thin Film; Device Package: 0603 (1608 Metric); Features: Anti-Sulfur; Height - Seated (Max): 0.022" (0.55mm); LastUpdated: 14/03/2023 7:28:48 pm; Lifecycle Status: Active; Minimum Order: 1; Number of Terminations: 2; Operating Temperature: -55°C ~ 155°C; Package / Case: 0603 (1608 Metric); Packaging: TapeAndReel; PartId: 14498; Part Status: Active; Price: 0.02; Resistance: 560 Ohms; Series: MCT - Professional; Size / Dimension: 0.061" L x 0.033" W (1.55mm x 0.85mm); Supplier 1: DigiKey; Supplier Part Number 1: MCT0603-560-CFCT-ND; Supplier Device Package: 0603; Tolerance: ±1%
R53 = CRGP0603F120K: RES 120K OHM 1% 1/4W 0603; Manufacturer: TE Connectivity Passive Product; Power (Watts): 0.25W, 1/4W; Temperature Coefficient: ±100ppm/°C; Part Number: CRGP0603F120K; Value: 120 kOhms; ComponentLink1Description: Datasheet; ComponentLink1URL: https://www.te.com/commerce/DocumentDelivery/DDEController?Action=srchrtrv&DocNm=9-1773463-9&DocType=DS&DocLang=English; ComponentLink2Description: DigiKey Link; ComponentLink2URL: https://www.digikey.com/en/products/detail/te-connectivity-passive-product/CRGP0603F120K/8577043; Composition: Thick Film; Device Package: 0603 (1608 Metric); Features: Pulse Withstanding; Height - Seated (Max): 0.022" (0.55mm); LastUpdated: 08/03/2023 8:30:17 pm; Lifecycle Status: Active; Minimum Order: 1; Number of Terminations: 2; Operating Temperature: -55°C ~ 155°C; Package / Case: 0603 (1608 Metric); Packaging: TapeAndReel; PartId: 5040; Part Status: Active; Price: 0.02; Resistance: 120 kOhms; Series: CRGP; Size / Dimension: 0.063" L x 0.031" W (1.60mm x 0.80mm); Supplier 1: DigiKey; Supplier Part Number 1: A130441CT-ND; Supplier Device Package: 0603; Tolerance: ±1%
R54 R57 R61 R63 = RNCS0603BKE10K0: RES 10K OHM 0.1% 1/16W 0603; Manufacturer: Stackpole Electronics Inc; Power (Watts): 0.063W, 1/16W; Temperature Coefficient: ±25ppm/°C; Part Number: RNCS0603BKE10K0; Value: 10 kOhms; ComponentLink1Description: Datasheet; ComponentLink1URL: https://www.seielect.com/catalog/sei-rncs_rnch.pdf; ComponentLink2Description: DigiKey Link; ComponentLink2URL: https://www.digikey.com/en/products/detail/stackpole-electronics-inc/RNCS0603BKE10K0/1708836; Composition: Thin Film; Device Package: 0603 (1608 Metric); Features: Anti-Corrosive, Automotive AEC-Q200, Moisture Resistant; Height - Seated (Max): 0.022" (0.55mm); LastUpdated: 08/03/2023 8:30:18 pm; Lifecycle Status: Active; Minimum Order: 1; Number of Terminations: 2; Operating Temperature: -55°C ~ 155°C; Package / Case: 0603 (1608 Metric); Packaging: TapeAndReel; PartId: 4838; Part Status: Active; Price: 0.07; Ratings: AEC-Q200; Resistance: 10 kOhms; Series: RNCS; Size / Dimension: 0.061" L x 0.031" W (1.55mm x 0.80mm); Supplier 1: DigiKey; Supplier Part Number 1: RNCS0603BKE10K0CT-ND; Supplier Device Package: 0603; Tolerance: ±0.1%
R55 = RK73H1JTTD1650F: RES 165 OHM 1% 1/8W 0603; Manufacturer: KOA Speer Electronics, Inc.; Power (Watts): 0.125W, 1/8W; Temperature Coefficient: ±100ppm/°C; Part Number: RK73H1JTTD1650F; Value: 165 Ohms; ComponentLink1Description: Datasheet; ComponentLink1URL: http://www.koaspeer.com/catimages/Products/RK73H/RK73H.pdf; ComponentLink2Description: DigiKey Link; ComponentLink2URL: https://www.digikey.com/en/products/detail/koa-speer-electronics-inc/RK73H1JTTD1650F/9845302; Composition: Thick Film; Device Package: 0603 (1608 Metric); Features: Automotive AEC-Q200, Moisture Resistant; Height - Seated (Max): 0.022" (0.55mm); LastUpdated: 14/03/2023 7:29:07 pm; Lifecycle Status: Active; Minimum Order: 1; Number of Terminations: 2; Operating Temperature: -55°C ~ 155°C; Package / Case: 0603 (1608 Metric); Packaging: CutTape; PartId: 8816; Part Status: Active; Price: 0.01; Ratings: AEC-Q200; Resistance: 165 Ohms; Series: RK73H; Size / Dimension: 0.063" L x 0.031" W (1.60mm x 0.80mm); Supplier 1: DigiKey; Supplier Part Number 1: 2019-RK73H1JTTD1650FCT-ND; Supplier Device Package: 0603; Tolerance: ±1%
R58 = CRGP0603F27K: RES 27K OHM 1% 1/4W 0603; Manufacturer: TE Connectivity Passive Product; Power (Watts): 0.25W, 1/4W; Temperature Coefficient: ±100ppm/°C; Part Number: CRGP0603F27K; Value: 27 kOhms; ComponentLink1Description: Datasheet; ComponentLink1URL: https://www.te.com/commerce/DocumentDelivery/DDEController?Action=srchrtrv&DocNm=9-1773463-9&DocType=DS&DocLang=English; ComponentLink2Description: DigiKey Link; ComponentLink2URL: https://www.digikey.com/en/products/detail/te-connectivity-passive-product/CRGP0603F27K/8577035; Composition: Thick Film; Device Package: 0603 (1608 Metric); Features: Pulse Withstanding; Height - Seated (Max): 0.022" (0.55mm); LastUpdated: 08/03/2023 8:30:17 pm; Lifecycle Status: Active; Minimum Order: 1; Number of Terminations: 2; Operating Temperature: -55°C ~ 155°C; Package / Case: 0603 (1608 Metric); Packaging: TapeAndReel; PartId: 5007; Part Status: Active; Price: 0.02; Resistance: 27 kOhms; Series: CRGP; Size / Dimension: 0.063" L x 0.031" W (1.60mm x 0.80mm); Supplier 1: DigiKey; Supplier Part Number 1: A130433CT-ND; Supplier Device Package: 0603; Tolerance: ±1%
R59 = RQ73C1J866RBTD: RES 866 OHMS 0.1% 0.15W 0603; Manufacturer: TE Connectivity Passive Product; Temperature Coefficient: ±10ppm/°C; Part Number: RQ73C1J866RBTD; Value: 866 Ohms; ComponentLink1Description: Datasheet; ComponentLink1URL: //media.digikey.com/pdf/Data%20Sheets/Tyco%20Electronics%20P%20B%20PDFs/RQ73-0618%20v2.pdf; ComponentLink2Description: DigiKey Link; ComponentLink2URL: https://www.digikey.com/en/products/detail/te-connectivity-passive-product/RQ73C1J866RBTD/9479913; Composition: Thin Film; Device Package: 0603 (1608 Metric); Features: Anti-Sulfur, Automotive AEC-Q200; Height - Seated (Max): 0.024" (0.60mm); LastUpdated: 14/03/2023 7:29:08 pm; Lifecycle Status: Active; Minimum Order: 1; Number of Terminations: 2; Operating Temperature: -55°C ~ 155°C; Package / Case: 0603 (1608 Metric); Packaging: TapeAndReel; PartId: 8503; Part Status: Active; Power (Watts): 0.15W; Price: 0.26; Ratings: AEC-Q200; Resistance: 866 Ohms; Series: RQ73; Size / Dimension: 0.061" L x 0.031" W (1.55mm x 0.80mm); Supplier 1: DigiKey; Supplier Part Number 1: A139965CT-ND; Supplier Device Package: 0603; Tolerance: ±0.1%
R60 = RMCF0603FT62K0: RES 62K OHM 1% 1/10W 0603; Manufacturer: Stackpole Electronics Inc; Power (Watts): 0.1W, 1/10W; Temperature Coefficient: ±100ppm/°C; Part Number: RMCF0603FT62K0; Value: 62 kOhms; ComponentLink1Description: Datasheet; ComponentLink1URL: https://www.seielect.com/catalog/sei-rmcf_rmcp.pdf; ComponentLink2Description: DigiKey Link; ComponentLink2URL: https://www.digikey.com/en/products/detail/stackpole-electronics-inc/RMCF0603FT62K0/1714175; Composition: Thick Film; Device Package: 0603 (1608 Metric); Features: Automotive AEC-Q200; Height - Seated (Max): 0.022" (0.55mm); LastUpdated: 08/03/2023 8:29:57 pm; Lifecycle Status: Active; Minimum Order: 1; Number of Terminations: 2; Operating Temperature: -55°C ~ 155°C; Package / Case: 0603 (1608 Metric); Packaging: CutTape; PartId: 10723; Part Status: Active; Price: 0.01; Ratings: AEC-Q200; Resistance: 62 kOhms; Series: RMCF; Size / Dimension: 0.061" L x 0.031" W (1.55mm x 0.80mm); Supplier 1: DigiKey; Supplier Part Number 1: RMCF0603FT62K0CT-ND; Supplier Device Package: 0603; Tolerance: ±1%
R62 = MCT06030C1100FP500: RES 110 OHM 1% 1/8W 0603; Manufacturer: Vishay Beyschlag; Power (Watts): 0.125W, 1/8W; Temperature Coefficient: ±50ppm/°C; Part Number: MCT06030C1100FP500; Value: 110 Ohms; ComponentLink1Description: Datasheet; ComponentLink1URL: http://www.vishay.com/docs/28705/mcx0x0xpro.pdf; ComponentLink2Description: DigiKey Link; ComponentLink2URL: http://digikey.com/product-detail/en/vishay-beyschlag/MCT06030C1100FP500/749-MCT06030C1100FP500CT-ND/10453856; Composition: Thin Film; Device Package: 0603 (1608 Metric); Features: Anti-Sulfur; Height - Seated (Max): 0.022" (0.55mm); LastUpdated: 14/03/2023 7:29:21 pm; Lifecycle Status: Active; Minimum Order: 1; Number of Terminations: 2; Operating Temperature: -55°C ~ 155°C; Package / Case: 0603 (1608 Metric); Packaging: TapeAndReel; PartId: 5092; Part Status: Active; Price: 0.02; Resistance: 110 Ohms; Series: MCT - Professional; Size / Dimension: 0.061" L x 0.033" W (1.55mm x 0.85mm); Supplier 1: DigiKey; Supplier Part Number 1: 749-MCT06030C1100FP500CT-ND; Supplier Device Package: 0603; Tolerance: ±1%
U1-U4 = BD9876AEFJ-E2: Buck Switching Regulator IC Positive Adjustable 1V 1 Output 3A 8-SOIC (0.154, 3.90mm Width) Exposed Pad; MF: Rohm; Availability: Bad; Package: SOIC-8 Rohm; Price: None; SnapEDA_Link: https://www.snapeda.com/parts/BD9876AEFJ-E2/Rohm/view-part/78992/?ref=snap; Value: *; MP: BD9876AEFJ-E2
VR17 = 3361P-1-504GLF: 500 kOhms 0.5W, 1/2W Gull Wing Surface Mount Trimmer Potentiometer Cermet 1.0 Turn Top Adjustment; MF: Bourns; Check_prices: https://www.snapeda.com/parts/3361P-1-504GLF/Bourns/view-part/?ref=eda; Digi-Key_Part_Number: 3361P-1-504GLFTR-ND; Package: 3361P Bourns; Value: *; MP: 3361P-1-504GLF; Purchase-URL: https://pricing.snapeda.com/search/part/3361P-1-504GLF/?ref=eda; SnapEDA_Link: https://www.snapeda.com/parts/3361P-1-504GLF/Bourns/view-part/?ref=snap

## Sheet rs485.SchDoc
size A4; SheetNumber: 4; SheetTotal: 4
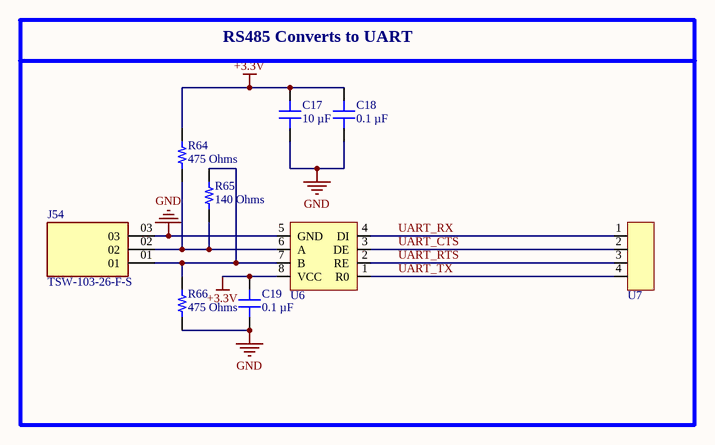
[diagram p3: rs485.SchDoc]

### Parts
C17  10 µF  [CAP 0603_1608]
C18  0.1 µF  [CAP 0603_1608]
C19  0.1 µF  [CAP 0603_1608]
J54  TSW-103-26-F-S  [SAMTEC_TSW-103-26-F-S]
R64  475 Ohms  [RES 0603_1608]
R65  140 Ohms  [RES 0603_1608]
R66  475 Ohms  [RES 0603_1608]
U6  SP3485  [SP3485]  (value not drawn)
U7  Con1x4_WireToWire  [Con1x4_WireToWire]  (value not drawn)

### Blocks framed on the sheet
RS485 Converts to UART: C17-C19 J54 R64-R66 U6 U7

### Nets
+3.3V: C17.2 C18.2 C19.2 R64.2 U6.8(VCC)
GND: C17.1 C18.1 C19.1 J54.03 R66.1 U6.5(GND)
UART_CTS: U6.3(DE) U7.2
UART_RTS: U6.2(RE) U7.3
UART_RX: U6.4(DI) U7.1
UART_TX: U6.1(R0) U7.4
NetJ54_01: J54.01 R65.2 R66.2 U6.7(B)
NetJ54_02: J54.02 R64.1 R65.1 U6.6(A)

### Library data of the parts
C17 = GRM188R60J106ME47D: CAP CER 10UF 6.3V X5R 0603; manufacturer: Murata Electronics; Tolerance: ±20%; Part Number: GRM188R60J106ME47D; Value: 10 µF; Applications: General Purpose; Capacitance: 10 µF; componentlink1description: Datasheet; componentlink1url: https://www.murata.com/~/media/webrenewal/support/library/catalog/products/capacitor/mlcc/c02e.ashx?la=en-us; componentlink2description: DigiKey Link; componentlink2url: https://www.digikey.com/en/products/detail/murata-electronics/GRM188R60J106ME47D/965910; Device Package: 0603 (1608 Metric); lastupdated: 08/03/2023 8:08:59 pm; Lifecycle Status: Active; Minimum Order: 1; Mounting Type: Surface Mount, MLCC; Operating Temperature: -55°C ~ 85°C; Package / Case: 0603 (1608 Metric); packaging: TapeAndReel; partid: 2351; Part Status: Active; price: 0.02; series: GRM; Size / Dimension: 0.063" L x 0.031" W (1.60mm x 0.80mm); Supplier 1: DigiKey; Supplier Part Number 1: 490-3896-1-ND; Temperature Coefficient: X5R; Thickness (Max): 0.035" (0.90mm); Voltage - Rated: 6.3V
C18 C19 = 6R3X14W104MV4T: CAP CER 0.1UF 6.3V X7R 0603; manufacturer: Johanson Dielectrics Inc.; Tolerance: ±20%; Part Number: 6R3X14W104MV4T; Value: 0.1 µF; Applications: Bypass, Decoupling; Capacitance: 0.1 µF; componentlink1description: Datasheet; componentlink1url: https://www.johansondielectrics.com/downloads/x2y-filter-and-decoupling-capacitors.pdf; componentlink2description: DigiKey Link; componentlink2url: https://www.digikey.com/en/products/detail/johanson-dielectrics-inc/6R3X14W104MV4T/1556331; Device Package: 0603 (1608 Metric); Features: Low ESL (X2Y); lastupdated: 08/03/2023 8:08:58 pm; Lifecycle Status: Active; Minimum Order: 1; Mounting Type: Surface Mount, MLCC; Operating Temperature: -55°C ~ 125°C; Package / Case: 0603 (1608 Metric); packaging: TapeAndReel; partid: 2650; Part Status: Active; price: 0.08; series: X2Y®; Size / Dimension: 0.064" L x 0.035" W (1.63mm x 0.89mm); Supplier 1: DigiKey; Supplier Part Number 1: 709-1009-1-ND; Temperature Coefficient: X7R; Thickness (Max): 0.026" (0.66mm); Voltage - Rated: 6.3V
R64 R66 = ERJ-PB3D4750V: RES SMD 475 OHM 0.5% 1/5W 0603; Manufacturer: Panasonic Electronic Components; Power (Watts): 0.2W, 1/5W; Temperature Coefficient: ±50ppm/°C; Part Number: ERJ-PB3D4750V; Value: 475 Ohms; ComponentLink1Description: Datasheet; ComponentLink1URL: https://industrial.panasonic.com/cdbs/www-data/pdf/RDM0000/AOA0000C328.pdf; ComponentLink2Description: DigiKey Link; ComponentLink2URL: http://digikey.com/product-detail/en/panasonic-electronic-components/ERJ-PB3D4750V/P20246CT-ND/6214501; Composition: Thick Film; Device Package: 0603 (1608 Metric); Features: Automotive AEC-Q200, Pulse Withstanding; Height - Seated (Max): 0.022" (0.55mm); LastUpdated: 08/03/2023 8:30:10 pm; Lifecycle Status: Active; Minimum Order: 1; Number of Terminations: 2; Operating Temperature: -55°C ~ 155°C; Package / Case: 0603 (1608 Metric); Packaging: TapeAndReel; PartId: 7092; Part Status: Active; Price: 0.02; Ratings: AEC-Q200; Resistance: 475 Ohms; Series: ERJ; Size / Dimension: 0.063" L x 0.031" W (1.60mm x 0.80mm); Supplier 1: DigiKey; Supplier Part Number 1: P20246CT-ND; Supplier Device Package: 0603; Tolerance: ±0.5%
R65 = RK73H1JTTD1400F: RES 140 OHM 1% 1/8W 0603; Manufacturer: KOA Speer Electronics, Inc.; Power (Watts): 0.125W, 1/8W; Temperature Coefficient: ±100ppm/°C; Part Number: RK73H1JTTD1400F; Value: 140 Ohms; ComponentLink1Description: Datasheet; ComponentLink1URL: http://www.koaspeer.com/catimages/Products/RK73H/RK73H.pdf; ComponentLink2Description: DigiKey Link; ComponentLink2URL: https://www.digikey.com/en/products/detail/koa-speer-electronics-inc/RK73H1JTTD1400F/9845188; Composition: Thick Film; Device Package: 0603 (1608 Metric); Features: Automotive AEC-Q200, Moisture Resistant; Height - Seated (Max): 0.022" (0.55mm); LastUpdated: 08/03/2023 8:30:04 pm; Lifecycle Status: Active; Minimum Order: 1; Number of Terminations: 2; Operating Temperature: -55°C ~ 155°C; Package / Case: 0603 (1608 Metric); Packaging: CutTape; PartId: 8740; Part Status: Active; Price: 0.01; Ratings: AEC-Q200; Resistance: 140 Ohms; Series: RK73H; Size / Dimension: 0.063" L x 0.031" W (1.60mm x 0.80mm); Supplier 1: DigiKey; Supplier Part Number 1: 2019-RK73H1JTTD1400FCT-ND; Supplier Device Package: 0603; Tolerance: ±1%
U7 = Con1x4_WireToWire: 1x4P XA 1 2.5mm 4 Copper Alloy Plugin,P=2.5mm Wire To Board / Wire To Wire Connector ROHS
J54 = TSW-103-26-F-S: Package: None; Price: None; Value: *; MP: TSW-103-26-F-S; Availability: Unavailable

## Nets that join several sheets
+3.3V: Voltage_Regulator (5 pins), rs485 (5 pins)
+12V: Digital_Testbed (32 pins), Analog_Testbed (16 pins), Voltage_Regulator (5 pins)
GND: Voltage_Regulator (41 pins), rs485 (6 pins)